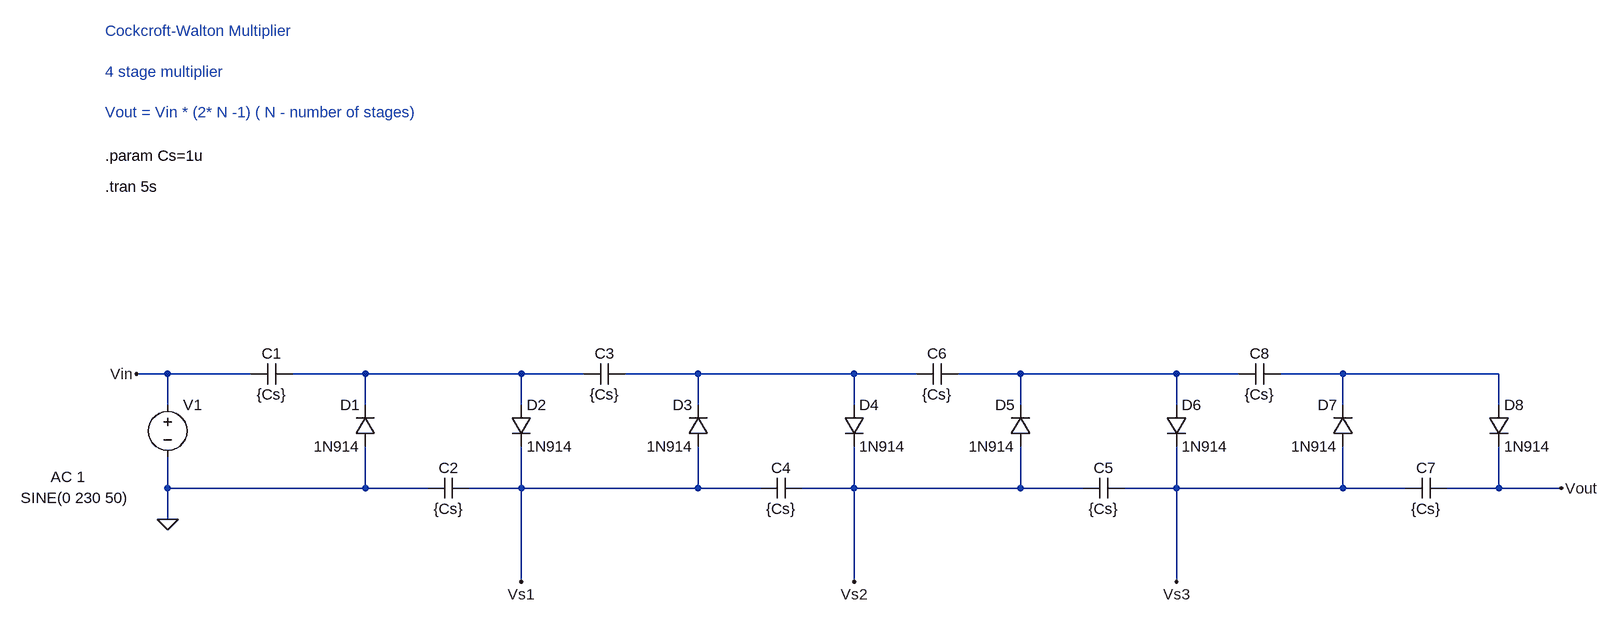
[diagram p0: schematic voltage_multiplier.asc]
voltage_multiplier.asc, the LTspice schematic file:
Version 4
SHEET 1 2184 680
WIRE -144 112 -192 112
WIRE -16 112 -144 112
WIRE 160 112 48 112
WIRE 400 112 160 112
WIRE 496 112 400 112
WIRE 672 112 560 112
WIRE 912 112 672 112
WIRE 1008 112 912 112
WIRE 1168 112 1072 112
WIRE 1408 112 1168 112
WIRE 1504 112 1408 112
WIRE 1664 112 1568 112
WIRE 1904 112 1664 112
WIRE -144 160 -144 112
WIRE 160 160 160 112
WIRE 400 160 400 112
WIRE 672 160 672 112
WIRE 912 160 912 112
WIRE 1168 160 1168 112
WIRE 1408 160 1408 112
WIRE 1664 160 1664 112
WIRE 1904 160 1904 112
WIRE -144 288 -144 240
WIRE 160 288 160 224
WIRE 160 288 -144 288
WIRE 256 288 160 288
WIRE 400 288 400 224
WIRE 400 288 320 288
WIRE 672 288 672 224
WIRE 672 288 400 288
WIRE 768 288 672 288
WIRE 912 288 912 224
WIRE 912 288 832 288
WIRE 1168 288 1168 224
WIRE 1168 288 912 288
WIRE 1264 288 1168 288
WIRE 1408 288 1408 224
WIRE 1408 288 1328 288
WIRE 1664 288 1664 224
WIRE 1664 288 1408 288
WIRE 1760 288 1664 288
WIRE 1904 288 1904 224
WIRE 1904 288 1824 288
WIRE 2000 288 1904 288
WIRE -144 336 -144 288
WIRE 400 432 400 288
WIRE 912 432 912 288
WIRE 1408 432 1408 288
FLAG -192 112 Vin
FLAG -144 336 0
FLAG 400 432 Vs1
FLAG 912 432 Vs2
FLAG 1408 432 Vs3
FLAG 2000 288 Vout
SYMBOL voltage -144 144 R0
WINDOW 3 -226 159 Left 2
WINDOW 123 -180 127 Left 2
WINDOW 39 0 0 Left 0
SYMATTR Value SINE(0 230 50)
SYMATTR Value2 AC 1
SYMATTR InstName V1
SYMBOL cap -16 128 R270
WINDOW 0 32 32 VTop 2
WINDOW 3 0 32 VBottom 2
SYMATTR InstName C1
SYMATTR Value {Cs}
SYMBOL diode 176 224 R180
WINDOW 0 24 64 Left 2
WINDOW 3 24 0 Left 2
SYMATTR InstName D1
SYMATTR Value 1N914
SYMBOL cap 320 272 R90
WINDOW 0 0 32 VBottom 2
WINDOW 3 32 32 VTop 2
SYMATTR InstName C2
SYMATTR Value {Cs}
SYMBOL diode 384 160 R0
SYMATTR InstName D2
SYMATTR Value 1N914
SYMBOL cap 496 128 R270
WINDOW 0 32 32 VTop 2
WINDOW 3 0 32 VBottom 2
SYMATTR InstName C3
SYMATTR Value {Cs}
SYMBOL diode 688 224 R180
WINDOW 0 24 64 Left 2
WINDOW 3 24 0 Left 2
SYMATTR InstName D3
SYMATTR Value 1N914
SYMBOL cap 832 272 R90
WINDOW 0 0 32 VBottom 2
WINDOW 3 32 32 VTop 2
SYMATTR InstName C4
SYMATTR Value {Cs}
SYMBOL diode 896 160 R0
SYMATTR InstName D4
SYMATTR Value 1N914
SYMBOL diode 1184 224 R180
WINDOW 0 24 64 Left 2
WINDOW 3 24 0 Left 2
SYMATTR InstName D5
SYMATTR Value 1N914
SYMBOL cap 1328 272 R90
WINDOW 0 0 32 VBottom 2
WINDOW 3 32 32 VTop 2
SYMATTR InstName C5
SYMATTR Value {Cs}
SYMBOL diode 1392 160 R0
SYMATTR InstName D6
SYMATTR Value 1N914
SYMBOL cap 1072 96 R90
WINDOW 0 0 32 VBottom 2
WINDOW 3 32 32 VTop 2
SYMATTR InstName C6
SYMATTR Value {Cs}
SYMBOL diode 1680 224 R180
WINDOW 0 24 64 Left 2
WINDOW 3 24 0 Left 2
SYMATTR InstName D7
SYMATTR Value 1N914
SYMBOL cap 1824 272 R90
WINDOW 0 0 32 VBottom 2
WINDOW 3 32 32 VTop 2
SYMATTR InstName C7
SYMATTR Value {Cs}
SYMBOL diode 1888 160 R0
SYMATTR InstName D8
SYMATTR Value 1N914
SYMBOL cap 1568 96 R90
WINDOW 0 0 32 VBottom 2
WINDOW 3 32 32 VTop 2
SYMATTR InstName C8
SYMATTR Value {Cs}
TEXT -240 -416 Left 2 ;Cockcroft-Walton Multiplier\n \n4 stage multiplier\n \nVout = Vin * (2* N -1) ( N - number of stages)
TEXT -240 -176 Left 2 !.tran 5s
TEXT -240 -224 Left 2 !.param Cs=1u

The netlist it stands for:
* voltage_multiplier.asc
V1 Vin 0 SINE(0 230 50) AC 1
C1 Vin N001 {Cs}
D1 0 N001 1N914
C2 Vs1 0 {Cs}
D2 N001 Vs1 1N914
C3 N001 N002 {Cs}
D3 Vs1 N002 1N914
C4 Vs2 Vs1 {Cs}
D4 N002 Vs2 1N914
D5 Vs2 N003 1N914
C5 Vs3 Vs2 {Cs}
D6 N003 Vs3 1N914
C6 N003 N002 {Cs}
D7 Vs3 N004 1N914
C7 Vout Vs3 {Cs}
D8 N004 Vout 1N914
C8 N004 N003 {Cs}
.model D D
.lib standard.dio
* Cockcroft-Walton Multiplier
* 4 stage multiplier
* Vout = Vin * (2* N -1) ( N - number of stages)
.tran 5s
.param Cs=1u
.backanno
.end